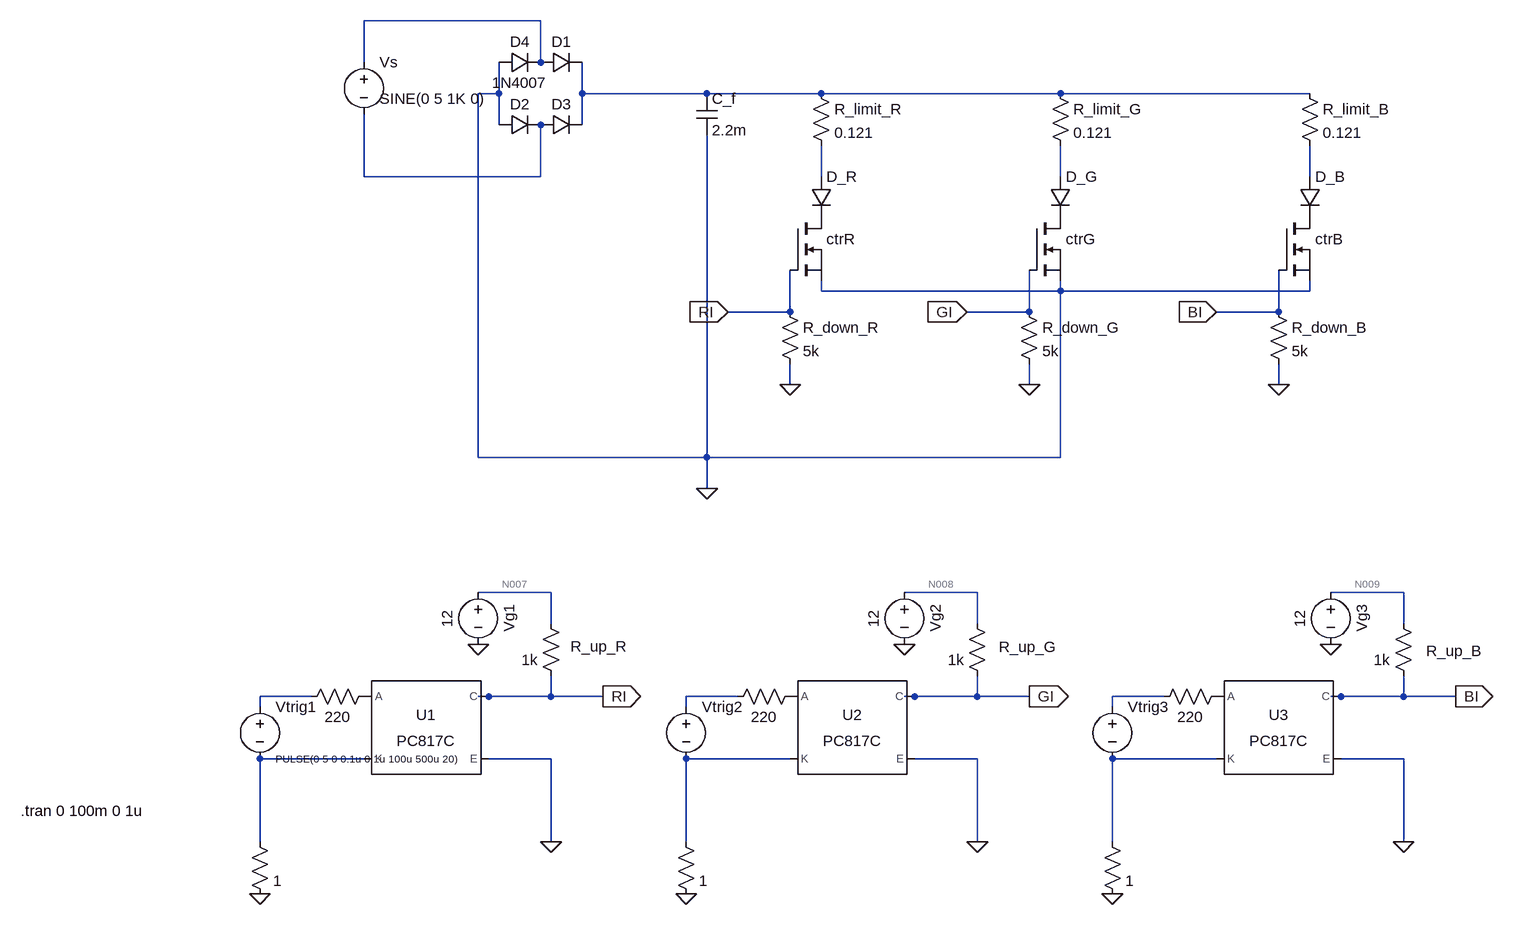
[diagram p0: schematic RGB LED.asc]
RGB LED.asc, the LTspice schematic file:
Version 4.1
SHEET 1 1288 1088
WIRE -336 -336 -608 -336
WIRE -608 -272 -608 -336
WIRE -336 -272 -336 -336
WIRE -400 -224 -400 -272
WIRE -400 -224 -432 -224
WIRE -272 -224 -272 -272
WIRE -80 -224 -272 -224
WIRE 96 -224 -80 -224
WIRE 464 -224 96 -224
WIRE 848 -224 464 -224
WIRE -400 -176 -400 -224
WIRE -272 -176 -272 -224
WIRE -608 -96 -608 -192
WIRE -336 -96 -336 -176
WIRE -336 -96 -608 -96
WIRE 96 -96 96 -144
WIRE 464 -96 464 -144
WIRE 848 -96 848 -144
WIRE 96 80 96 64
WIRE 464 80 464 64
WIRE 464 80 96 80
WIRE 848 80 848 64
WIRE 848 80 464 80
WIRE 48 112 48 48
WIRE 48 112 -48 112
WIRE 416 112 416 48
WIRE 416 112 320 112
WIRE 800 112 800 48
WIRE 800 112 704 112
WIRE 48 224 48 192
WIRE 416 224 416 192
WIRE 800 224 800 192
WIRE -432 336 -432 -224
WIRE -80 336 -80 -160
WIRE -80 336 -432 336
WIRE 464 336 464 80
WIRE 464 336 -80 336
WIRE -80 384 -80 336
WIRE -320 544 -432 544
WIRE 336 544 224 544
WIRE 992 544 880 544
WIRE -320 592 -320 544
WIRE 336 592 336 544
WIRE 992 592 992 544
WIRE -688 704 -768 704
WIRE -416 704 -432 704
WIRE -320 704 -320 672
WIRE -320 704 -416 704
WIRE -240 704 -320 704
WIRE -32 704 -112 704
WIRE 240 704 224 704
WIRE 336 704 336 672
WIRE 336 704 240 704
WIRE 416 704 336 704
WIRE 624 704 544 704
WIRE 896 704 880 704
WIRE 992 704 992 672
WIRE 992 704 896 704
WIRE 1072 704 992 704
WIRE -768 720 -768 704
WIRE -112 720 -112 704
WIRE 544 720 544 704
WIRE -608 800 -768 800
WIRE -320 800 -416 800
WIRE 48 800 -112 800
WIRE 336 800 240 800
WIRE 704 800 544 800
WIRE 992 800 896 800
WIRE -768 928 -768 800
WIRE -320 928 -320 800
WIRE -112 928 -112 800
WIRE 336 928 336 800
WIRE 544 928 544 800
WIRE 992 928 992 800
FLAG -48 112 RI
IOPIN -48 112 In
FLAG 320 112 GI
IOPIN 320 112 In
FLAG 704 112 BI
IOPIN 704 112 In
FLAG -240 704 RI
IOPIN -240 704 Out
FLAG 416 704 GI
IOPIN 416 704 Out
FLAG 1072 704 BI
IOPIN 1072 704 Out
FLAG -320 928 0
FLAG -432 624 0
FLAG 336 928 0
FLAG 224 624 0
FLAG 992 928 0
FLAG 880 624 0
FLAG 48 224 0
FLAG 416 224 0
FLAG 800 224 0
FLAG -768 1008 0
FLAG -112 1008 0
FLAG 544 1008 0
FLAG -80 384 0
SYMBOL diode 80 -96 R0
WINDOW 3 24 64 Invisible 2
SYMATTR Value LXZ1-PX01
SYMATTR InstName D_R
SYMBOL nmos 48 -32 R0
WINDOW 3 56 72 Invisible 2
SYMATTR Value IRFR120Z
SYMATTR InstName ctrR
SYMBOL voltage -608 -288 R0
WINDOW 123 24 44 Left 2
WINDOW 39 0 0 Left 0
WINDOW 3 24 72 Left 2
SYMATTR Value SINE(0 5 1K 0)
SYMATTR InstName Vs
SYMBOL diode -400 -256 R270
WINDOW 0 32 32 VTop 2
WINDOW 3 0 32 VBottom 2
SYMATTR InstName D4
SYMATTR Value 1N4007
SYMBOL diode -400 -160 R270
WINDOW 0 32 32 VTop 2
WINDOW 3 0 32 Invisible 2
SYMATTR InstName D2
SYMATTR Value 1N4007
SYMBOL diode -336 -256 R270
WINDOW 0 32 32 VTop 2
WINDOW 3 0 32 Invisible 2
SYMATTR InstName D1
SYMATTR Value 1N4007
SYMBOL diode -336 -160 R270
WINDOW 0 32 32 VTop 2
WINDOW 3 0 32 Invisible 2
SYMATTR InstName D3
SYMATTR Value 1N4007
SYMBOL voltage -768 704 R0
WINDOW 3 24 96 Left 1
WINDOW 123 0 0 Left 0
WINDOW 39 0 0 Left 0
SYMATTR Value PULSE(0 5 0 0.1u 0.1u 100u 500u 20)
SYMATTR InstName Vtrig1
SYMBOL res -592 688 R90
WINDOW 0 0 56 Invisible 2
WINDOW 3 32 56 VTop 2
SYMATTR InstName R7
SYMATTR Value 220
SYMBOL voltage -432 528 R0
WINDOW 0 32 56 VTop 2
WINDOW 3 -32 56 VBottom 2
WINDOW 123 0 0 Left 0
WINDOW 39 0 0 Left 0
SYMATTR InstName Vg1
SYMATTR Value 12
SYMBOL res 64 688 R90
WINDOW 0 0 56 Invisible 2
WINDOW 3 32 56 VTop 2
SYMATTR InstName R3
SYMATTR Value 220
SYMBOL res 720 688 R90
WINDOW 0 0 56 Invisible 2
WINDOW 3 32 56 VTop 2
SYMATTR InstName R9
SYMATTR Value 220
SYMBOL cap -96 -224 R0
SYMATTR InstName C_f
SYMATTR Value 2.2m
SYMATTR SpiceLine V=50
SYMBOL nmos 416 -32 R0
WINDOW 3 56 72 Invisible 2
SYMATTR Value IRFR120Z
SYMATTR InstName ctrG
SYMBOL nmos 800 -32 R0
WINDOW 3 56 72 Invisible 2
SYMATTR Value IRFR120Z
SYMATTR InstName ctrB
SYMBOL res 448 -240 R0
SYMATTR InstName R_limit_G
SYMATTR Value 0.121
SYMBOL diode 448 -96 R0
WINDOW 3 24 64 Invisible 2
SYMATTR Value LXZ1-PX01
SYMATTR InstName D_G
SYMBOL diode 832 -96 R0
WINDOW 3 24 64 Invisible 2
SYMATTR Value LXZ1-PX01
SYMATTR InstName D_B
SYMBOL Optos\\PC817C -512 752 R0
SYMATTR InstName U1
SYMBOL Optos\\PC817C 144 752 R0
SYMATTR InstName U2
SYMBOL Optos\\PC817C 800 752 R0
SYMATTR InstName U3
SYMBOL res -304 688 R180
WINDOW 0 -14 61 Right 2
WINDOW 3 36 40 Left 2
SYMATTR InstName R_up_R
SYMATTR Value 1k
SYMBOL voltage 224 528 R0
WINDOW 0 32 56 VTop 2
WINDOW 3 -32 56 VBottom 2
WINDOW 123 0 0 Left 0
WINDOW 39 0 0 Left 0
SYMATTR InstName Vg2
SYMATTR Value 12
SYMBOL res 352 688 R180
WINDOW 0 -107 60 Left 2
WINDOW 3 36 40 Left 2
SYMATTR InstName R_up_G
SYMATTR Value 1k
SYMBOL voltage 880 528 R0
WINDOW 0 32 56 VTop 2
WINDOW 3 -32 56 VBottom 2
WINDOW 123 0 0 Left 0
WINDOW 39 0 0 Left 0
SYMATTR InstName Vg3
SYMATTR Value 12
SYMBOL res 1008 688 R180
WINDOW 0 -106 54 Left 2
WINDOW 3 36 40 Left 2
SYMATTR InstName R_up_B
SYMATTR Value 1k
SYMBOL res 80 -240 R0
SYMATTR InstName R_limit_R
SYMATTR Value 0.121
SYMBOL res 832 -240 R0
SYMATTR InstName R_limit_B
SYMATTR Value 0.121
SYMBOL res 32 96 R0
SYMATTR InstName R_down_R
SYMATTR Value 5k
SYMBOL res 400 96 R0
SYMATTR InstName R_down_G
SYMATTR Value 5k
SYMBOL res 784 96 R0
SYMATTR InstName R_down_B
SYMATTR Value 5k
SYMBOL res -784 912 R0
WINDOW 0 36 40 Invisible 2
SYMATTR InstName R13
SYMATTR Value 1
SYMBOL res -128 912 R0
WINDOW 0 36 40 Invisible 2
SYMATTR InstName R14
SYMATTR Value 1
SYMBOL res 528 912 R0
WINDOW 0 36 40 Invisible 2
SYMATTR InstName R15
SYMATTR Value 1
SYMBOL voltage -112 704 R0
WINDOW 3 24 96 Invisible 1
WINDOW 123 0 0 Left 0
WINDOW 39 0 0 Left 0
SYMATTR Value PULSE(0 5 0 0.1u 0.1u 250u 500u)
SYMATTR InstName Vtrig2
SYMBOL voltage 544 704 R0
WINDOW 3 24 96 Invisible 1
WINDOW 123 0 0 Left 0
WINDOW 39 0 0 Left 0
SYMATTR Value PULSE(0 5 0 0.1u 0.1u 350u 500u 20)
SYMATTR InstName Vtrig3
TEXT -1136 880 Left 2 !.tran 0 100m 0 1u

The netlist it stands for:
* RGB LED.asc
D_R N004 P001 LXZ1-PX01
M§ctrR P001 RI 0 0 IRFR120Z
Vs N001 N003 SINE(0 5 1K 0)
D4 0 N001 1N4007
D2 0 N003 1N4007
D1 N001 N002 1N4007
D3 N003 N002 1N4007
Vtrig1 N010 N013 PULSE(0 5 0 0.1u 0.1u 100u 500u 20)
R7 P002 N010 220
Vg1 N007 0 12
R3 P003 N011 220
R9 P004 N012 220
C_f N002 0 2.2m V=50
M§ctrG P005 GI 0 0 IRFR120Z
M§ctrB P006 BI 0 0 IRFR120Z
R_limit_G N002 N005 0.121
D_G N005 P005 LXZ1-PX01
D_B N006 P006 LXZ1-PX01
X§U1 P002 N013 RI 0 PC817 Igain=2.3m  ; PC817C, pins A K C E
X§U2 P003 N014 GI 0 PC817 Igain=2.3m  ; PC817C, pins A K C E
X§U3 P004 N015 BI 0 PC817 Igain=2.3m  ; PC817C, pins A K C E
R_up_R RI N007 1k
Vg2 N008 0 12
R_up_G GI N008 1k
Vg3 N009 0 12
R_up_B BI N009 1k
R_limit_R N002 N004 0.121
R_limit_B N002 N006 0.121
R_down_R RI 0 5k
R_down_G GI 0 5k
R_down_B BI 0 5k
R13 N013 0 1
R14 N014 0 1
R15 N015 0 1
Vtrig2 N011 N014 PULSE(0 5 0 0.1u 0.1u 250u 500u)
Vtrig3 N012 N015 PULSE(0 5 0 0.1u 0.1u 350u 500u 20)
.model D D
.lib standard.dio
.model NMOS NMOS
.model PMOS PMOS
.lib standard.mos
.tran 0 100m 0 1u
.lib PC817.sub
.backanno
.end

* Results of the author's LTspice run, read from the files saved beside the schematic
* Operating Point, zero values left out:
*   V(bi) = 10 V
*   V(gi) = 10 V
*   V(n007) = 12 V
*   V(n008) = 12 V
*   V(n009) = 12 V
*   V(ri) = 10 V
*   I(R_down_B) = 2 mA
*   I(R_down_G) = 2 mA
*   I(R_down_R) = 2 mA
*   I(R_up_B) = -2 mA
*   I(R_up_G) = -2 mA
*   I(R_up_R) = -2 mA
*   I(Vg1) = -2 mA
*   I(Vg2) = -2 mA
*   I(Vg3) = -2 mA
*   Ix(u1:3) = 38.33 pA
*   Ix(u1:4) = -38.33 pA
*   Ix(u2:3) = 38.33 pA
*   Ix(u2:4) = -38.33 pA
*   Ix(u3:3) = 38.33 pA
*   Ix(u3:4) = -38.33 pA